# EAGLE design esp8266-01relayfabab-CONPLANOMASA (EAGLE 7.2.0)
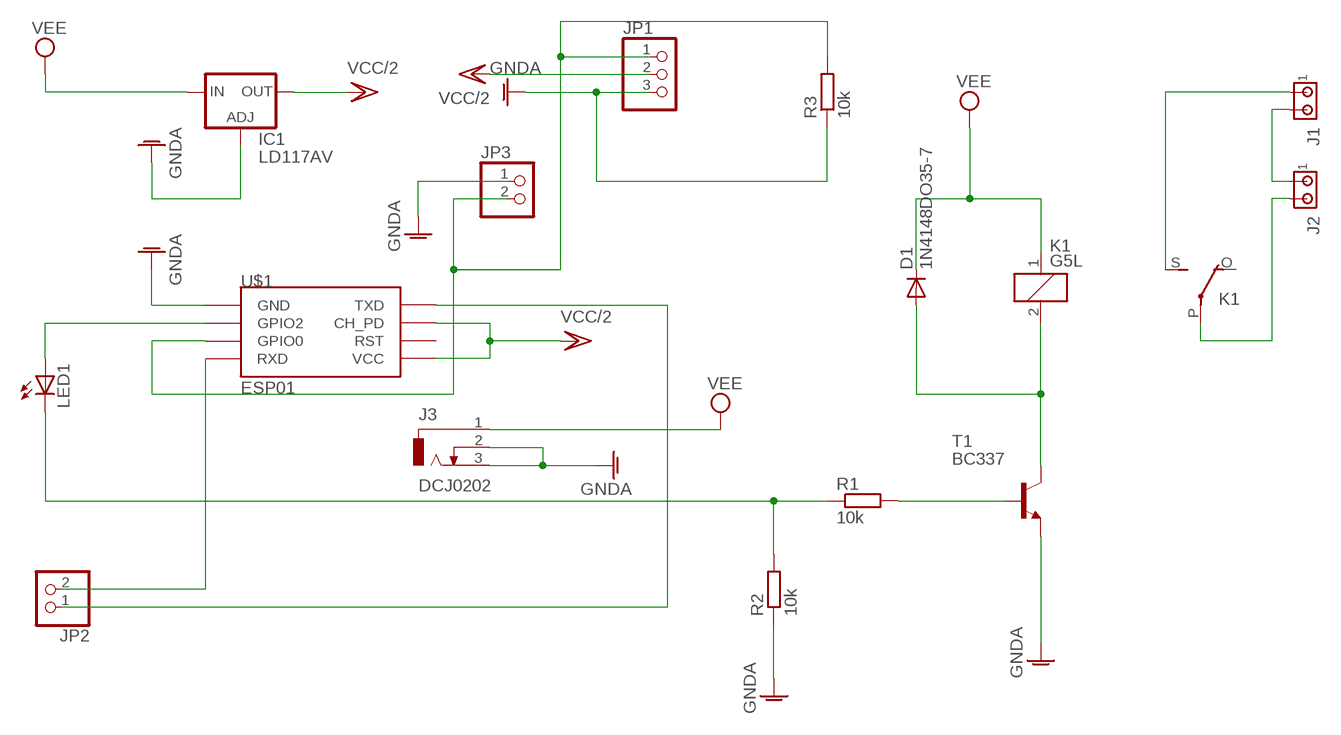
[diagram p0: schematic, sheet 1]

## Parts
D1  1N4148DO35-7  [DO35-7]
IC1  LD117AV  [TO220L1]
J1  MTA02-156  [1X2MTA]
J2  MTA02-156  [1X2MTA]
J3  DCJ0202  [DCJ0202]
JP1  PINHD-1X3  [1X03]
JP2  PINHD-1X2  [1X02]
JP3  PINHD-1X2  [1X02]
K1  G5L  [G5LE]
LED1  LED5MM  [LED5MM]
R1  10k  R-EU_0207/7  [0207/7]
R2  10k  R-EU_0207/7  [0207/7]
R3  10k  R-EU_0207/7  [0207/7]
T1  BC337  [TO92]
U$1  ESP01  [ESP01]

## Nets
GND: IC1.1(ADJ) J3.2 J3.3 JP1.3 JP3.1 R2.1 R3.1 T1.1(E) U$1.GND ; supply symbol labelled GNDA
N$1 [power]: J1.2 J2.1
N$2: LED1.K(C) R1.1 R2.2
N$3: JP1.1 JP3.2 R3.2 U$1.GPIO0
N$4: JP2.1 U$1.TX(TXD)
N$5: JP2.2 U$1.RX(RXD)
N$6: D1.A K1.2 T1.3(C)
N$7: R1.2 T1.2(B)
N$8 [power]: J1.1 K1.S(2:S)
N$9 [power]: J2.2 K1.P(2:P)
N$10: LED1.A U$1.GPIO2
VCC/2: IC1.2(OUT) JP1.2 U$1.CH_PD U$1.VCC
VEE: D1.C IC1.3(IN) J3.1 K1.1
Unconnected: K1.O(2:O) U$1.RST

## Library data of the parts
D1 = diode:1N4148: DIODE high speed (Philips)
IC1 = v-reg:LD117A?*: Low drop fixed and adjustable positive voltage regulators 1 A Source: http://www.st.com/stonline/products/literature/ds/7194/ld1117axx.pdf
J1 J2 = con-amp:MTA02-156: AMP connector
J3 = con-jack:DCJ0202: DC POWER JACK Source: DCJ0202.pdf; OC_FARNELL: unknown; OC_NEWARK: unknown
JP1 = pinhead:PINHD-1X3: PIN HEADER
JP2 JP3 = pinhead:PINHD-1X2: PIN HEADER
K1 = relay:G5L: RELAY 1 x switch, 10 A/120 V AC, 8 A/30 V ADC, Omron; OC_FARNELL: unknown; OC_NEWARK: unknown
LED1 = adafruit:LED: LED OSRAM: - CHIPLED LG R971, LG N971, LY N971, LG Q971, LY Q971, LO R971, LY R971 LH N974, LH R974 LS Q976, LO Q976, LY Q976 LO Q996 - Hyper CHIPLED LW Q18S LB Q993, LB Q99A, LB R99A - SideLED LS A670, LO A670, LY A670, LG A670, LP A670 LB A673, LV A673, LT A673, LW A673 LH A674 LY A675 LS A676, LA A676, LO A676, LY A676, LW A676 LS A679, LY A679, LG A679 - Hyper Micro SIDELED® LS Y876, LA Y876, LO Y876, LY Y876 LT Y87S - SmartLED LW L88C, LW L88S LB L89C, LB L89S, LG L890 LS L89K, LO L89K, LY L89K LS L896, LA L896, LO L896, LY L896 - TOPLED LS T670, LO T670, LY T670, LG T670, LP T670 LSG T670, LSP T670, LSY T670, LOP T670, LYG T670 LG T671, LOG T671, LSG T671 LB T673, LV T673, LT T673, LW T673 LH T674 LS T676, LA T676, LO T676, LY T676, LB T676, LH T676, LSB T676, LW T676 LB T67C, LV T67C, LT T67C, LS T67K, LO T67K, LY T67K, LW E67C LS E67B, LA E67B, LO E67B, LY E67B, LB E67C, LV E67C, LT E67C LW T67C LS T679, LY T679, LG T679 LS T770, LO T770, LY T770, LG T770, LP T770 LB T773, LV T773, LT T773, LW T773 LH T774 LS E675, LA E675, LY E675, LS T675 LS T776, LA T776, LO T776, LY T776, LB T776 LHGB T686 LT T68C, LB T68C - Hyper Mini TOPLED® LB M676 - Mini TOPLED Santana® LG M470 LS M47K, LO M47K, LY M47K Source: http://www.osram.convergy.de/
R1-R3 = resistor:R-EU_: RESISTOR, European symbol
T1 = transistor:BC337: NPN TRANSISTOR
U$1 = esp8266modules:ESP01: ESP8266 Wifi module 01

## Net classes
1 power: width 1.016 mm

## Board
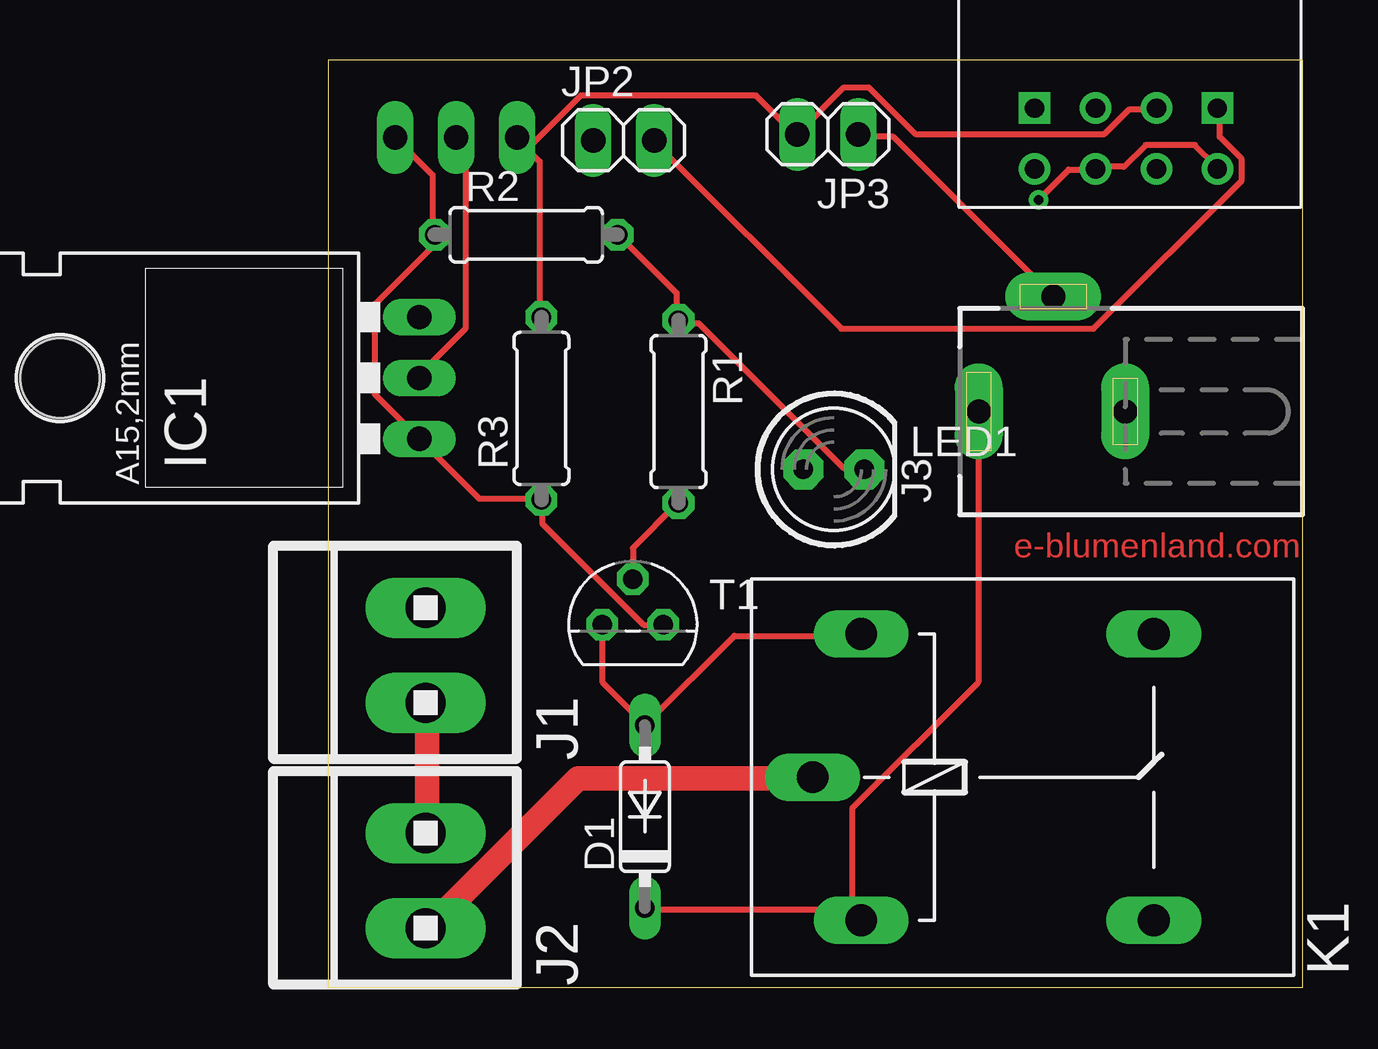
[diagram p1: board, top side]
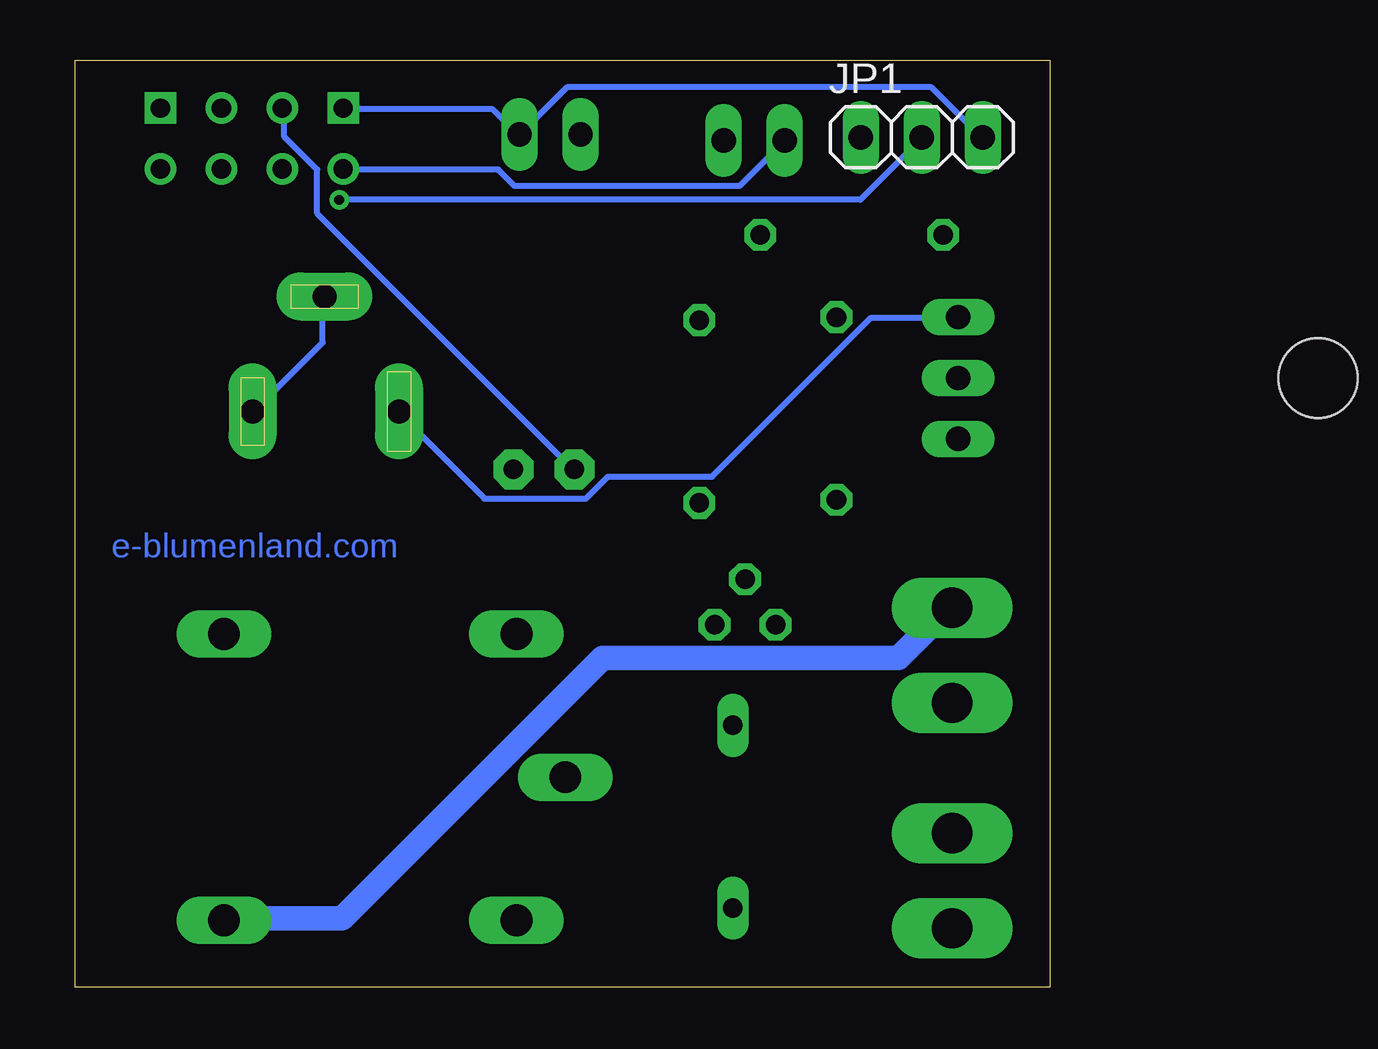
[diagram p2: board, bottom side, seen from below]

Size 40.62 x 38.66 mm. Coordinates in mm from the lower left corner, seen from the top.
Outline: 0,0 40.62,0 40.62,38.66 0,38.66 0,0
Copper layers (1*16): Top 0.035mm / dielectric 1.5mm / Bottom 0.035mm
Design rules "default *": minimum track width 10mil, minimum drill 16mil, track to track 8mil, track to pad 8mil, pad to pad 8mil, via to via 8mil, smd to smd 8mil, copper to edge 40mil, drill to drill 8mil, minimum pad ring 10mil, minimum via ring 8mil, stop-mask expansion 4mil, vias tented up to drill 0mil, thermal gap 10mil

### Footprints (pad centres in the part's own frame; a part is rotated, then mirrored left to right if it is on the bottom)
DO35-7 = drill 0.813 long: A 3.81,0; C -3.81,0
TO220L1 = drill 1.016 long: 1 -2.54,-3.81; 2 0,-3.81; 3 2.54,-3.81 | hole 3.302: 0,11.176
1X2MTA = drill 1.676 long: 1 1.981,0; 2 -1.981,0
DCJ0202 = drill 1 pad 2 long: 1 0,3.1; 2 4.8,0; 3 0,-3
1X03 = drill 1.016 long: 1 -2.54,0; 2 0,0; 3 2.54,0
1X02 = drill 1.016 long: 1 -1.27,0; 2 1.27,0
G5LE = drill 1.321 long: 1 -7.493,-5.969; 2 -7.493,5.969; O 4.699,5.969; P -9.525,0; S 4.699,-5.969
LED5MM = drill 0.813 pad 1.676 octagon: A -1.27,0; K 1.27,0
0207/7 = drill 0.813 octagon: 1 -3.81,0; 2 3.81,0
TO92 = drill 0.813 octagon: 1 1.27,0; 2 0,1.905; 3 -1.27,0
ESP01 = drill 0.8: CH_PD -1.285,-8.178; GPIO0 1.255,-5.638; GPIO2 -1.285,-5.638; RST 1.255,-8.178; TX -3.825,-8.178; VCC 3.795,-8.178 | drill 0.8 square: GND -3.825,-5.638; RX 3.795,-5.638

### Placement (x,y rotation side)
D1  13.21,7.11 90 top
IC1  0,25.4 90 top
J1  4.06,13.84 90 top
J2  4.06,4.45 90 top
J3  30.23,24 90 top
JP1  5.33,35.43 0 bottom
JP2  12.32,35.31 0 top
JP3  20.83,35.56 180 top
K1  29.72,8.76 0 top
LED1  21.08,21.59 0 top
R1  14.6,24 270 top
R2  8.25,31.37 0 top
R3  8.89,24.13 90 top
T1  12.7,15.11 0 top
U$1  33.27,42.29 0 top

### Tracks (layer width: path | path; a pad name or v marks a point on that pad's centre or on a via)
GND
  Top 0.254: JP3.1 22.19,35.46 23.56,35.46 30.19,28.83 J3.2 | JP1.3 2.87,35.34 4.36,33.86 4.36,31.46 R2.1 4.36,31.34 4.36,30.89 1.96,28.49 1.96,24.71 IC1.1 6.3,20.37 8.81,20.37 R3.1 8.93,20.26 8.93,19.34 13.16,15.11 T1.1
  Bottom 0.254: U$1.GND 29.39,36.6 23.22,36.6 22.19,35.57 JP3.1 22.07,35.57 20.13,37.52 4.93,37.52 2.87,35.46 JP1.3 | J3.2 30.3,28.72 30.3,26.89 33.16,24.03 J3.3
N$1
  Top 1.016: J2.1 4.13,6.43 4.13,11.8 J1.2
N$2
  Top 0.254: R2.2 12.13,31.34 14.53,28.94 14.53,27.92 R1.1 14.64,27.69 15.44,27.69 21.5,21.63 22.3,21.63 LED1.K
N$3
  Top 0.254: R3.2 8.81,28.03 8.81,34.43 7.9,35.34 JP1.1 8.36,35 10.53,37.17 17.84,37.17 19.44,35.57 JP3.2 19.56,35.57 21.5,37.52 22.53,37.52 24.47,35.57 32.36,35.57 33.39,36.6 34.42,36.6 U$1.GPIO0
N$4
  Bottom 0.254: U$1.TX 29.39,34.09 22.99,34.09 22.3,33.4 12.93,33.4 11.1,35.23 JP2.1
N$5
  Top 0.254: U$1.RX 37.16,36.6 37.16,35.46 38.08,34.54 38.08,33.63 31.9,27.46 21.39,27.46 13.61,35.23 JP2.2
N$6
  Top 0.254: T1.3 11.44,15.11 11.44,12.71 13.16,11 D1.A 13.27,11 16.93,14.66 22.19,14.66 K1.2
N$7
  Top 0.254: T1.2 12.7,18.31 14.53,20.14 R1.2
N$8
  Bottom 1.016: K1.S 34.42,2.88 29.5,2.88 18.64,13.74 6.3,13.74 4.13,15.91 J1.1
N$9
  Top 1.016: K1.P 20.13,8.71 10.41,8.71 4.13,2.43 J2.2
N$10
  Bottom 0.254: U$1.GPIO2 31.9,36.6 31.9,35.46 30.53,34.09 30.53,32.26 19.9,21.63 LED1.A
VCC/2  (via drill 0.41)
  Top 0.254: U$1.VCC 37.05,34.2 36.13,35.11 34.07,35.11 33.16,34.2 32.02,34.2 U$1.CH_PD 31.9,34.09 30.87,34.09 v29.62,32.83 | IC1.2 3.9,25.4 3.9,25.63 5.73,27.46 5.73,35 5.38,35.34 JP1.2
  Bottom 0.254: v29.62,32.83 7.9,32.83 5.38,35.34 JP1.2
VEE
  Top 0.254: D1.C 13.27,3.23 21.84,3.23 22.19,2.88 K1.1 21.84,3.34 21.84,7.45 27.1,12.71 27.1,23.91 J3.1
  Bottom 0.254: IC1.3 3.9,27.92 7.44,27.92 14.07,21.28 18.41,21.28 19.33,20.37 23.56,20.37 27.1,23.91 J3.1

### Text on the board
Top: e-blumenland.com
Bottom: e-blumenland.com